# EAGLE design chainclock (EAGLE 7.7.0)
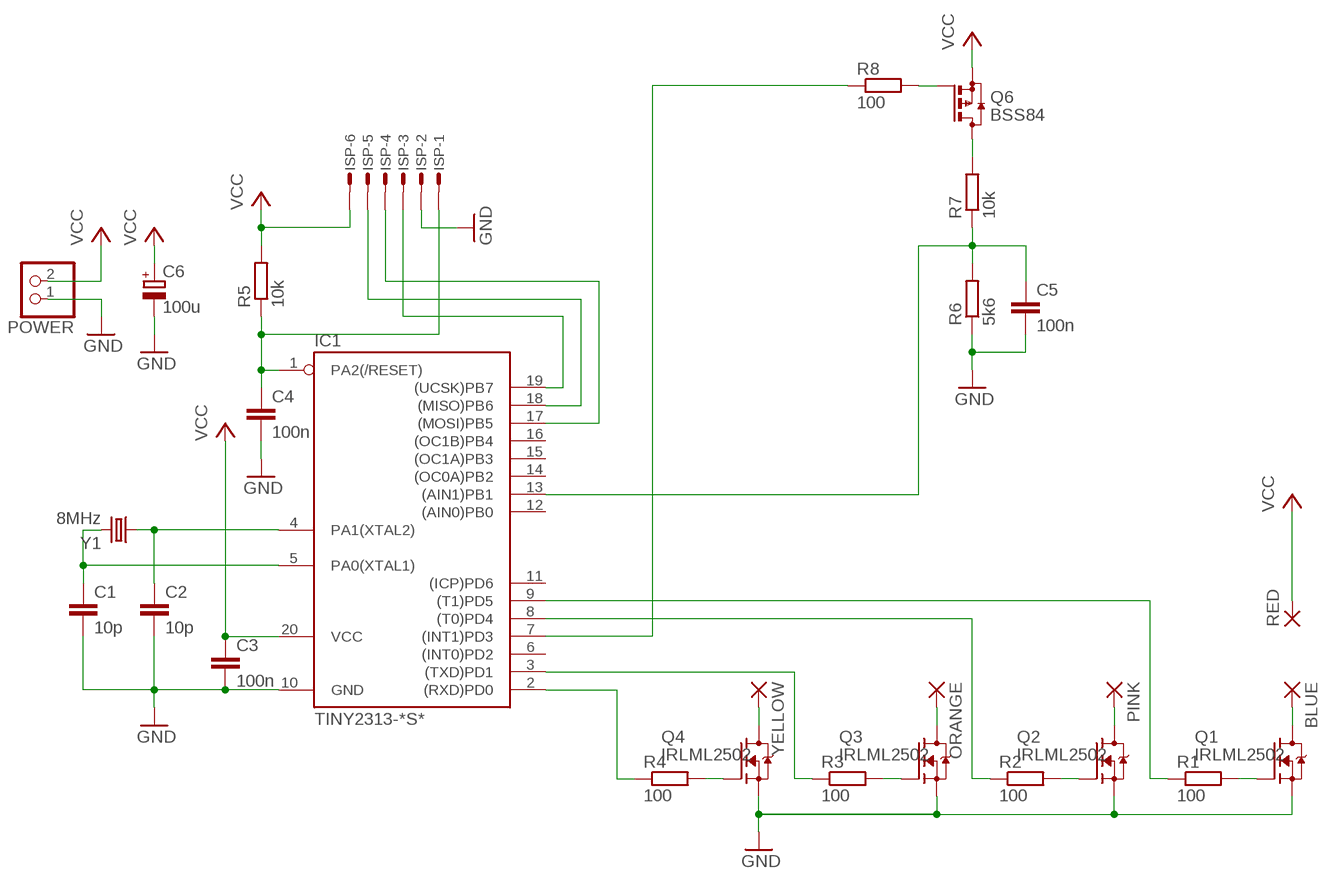
[diagram p0: schematic, sheet 1]

## Parts
BLUE  SMD2  [SMD1,27-2,54]
C1  10p  C-EUC0603  [C0603]
C2  10p  C-EUC0603  [C0603]
C3  100n  C-EUC0603  [C0603]
C4  100n  C-EUC0603  [C0603]
C5  100n  C-EUC0603  [C0603]
C6  100u  CPOL-EUE2.5-6  [E2,5-6]
IC1  TINY2313-*S*  [SO20L$]
ISP  MICROMATCH-6SMF  [MMT-F-SMD-6]
ORANGE  SMD2  [SMD1,27-2,54]
PINK  SMD2  [SMD1,27-2,54]
POWER  PINHD-1X2/90  [1X02/90]
Q1  IRLML2502  [SOT23-3]
Q2  IRLML2502  [SOT23-3]
Q3  IRLML2502  [SOT23-3]
Q4  IRLML2502  [SOT23-3]
Q6  BSS84  [SOT23]
R1  100  R-EU_R0603  [R0603]
R2  100  R-EU_R0603  [R0603]
R3  100  R-EU_R0603  [R0603]
R4  100  R-EU_R0603  [R0603]
R5  10k  R-EU_R0603  [R0603]
R6  5k6  R-EU_R0603  [R0603]
R7  10k  R-EU_R0603  [R0603]
R8  100  R-EU_R0603  [R0603]
RED  SMD2  [SMD1,27-2,54]
Y1  8MHz  CRYSTALHC49UP  [HC49UP]
YELLOW  SMD2  [SMD1,27-2,54]

## Nets
GND: C1.2 C2.2 C3.2 C4.2 C5.2 C6.- IC1.10(GND) ISP.2 POWER.1 Q1.2(S) Q2.2(S) Q3.2(S) Q4.2(S) R6.1
N$1: Q3.1(G) R3.2
N$2: Q4.1(G) R4.2
N$3: Q2.1(G) R2.2
N$4: Q1.1(G) R1.2
N$5: C4.1 IC1.1(PA2(/RESET)) ISP.1 R5.1
N$6: Q4.3(D) YELLOW.1(P)
N$7: ORANGE.1(P) Q3.3(D)
N$8: PINK.1(P) Q2.3(D)
N$9: BLUE.1(P) Q1.3(D)
N$10: C2.1 IC1.4(PA1(XTAL2)) Y1.1
N$11: C1.1 IC1.5(PA0(XTAL1)) Y1.2
N$12: IC1.19((UCSK)PB7) ISP.3
N$13: C5.1 IC1.13((AIN1)PB1) R6.2 R7.1
N$14: IC1.9((T1)PD5) R1.1
N$15: IC1.8((T0)PD4) R2.1
N$17: IC1.2((RXD)PD0) R4.1
N$18: Q6.3(D) R7.2
N$19: Q6.1(G) R8.2
N$20: IC1.7((INT1)PD3) R8.1
N$21: IC1.3((TXD)PD1) R3.1
N$63: IC1.17((MOSI)PB5) ISP.4
N$66: IC1.18((MISO)PB6) ISP.5
VCC: C3.1 C6.+ IC1.20(VCC) ISP.6 POWER.2 Q6.2(S) R5.2 RED.1(P)
Unconnected: IC1.6((INT0)PD2) IC1.11((ICP)PD6) IC1.12((AIN0)PB0) IC1.14((OC0A)PB2) IC1.15((OC1A)PB3) IC1.16((OC1B)PB4)

## Library data of the parts
BLUE ORANGE PINK RED YELLOW = wirepad:SMD2: SMD PAD
C1-C5 = rcl:C-EU: CAPACITOR, European symbol
C6 = rcl:CPOL-EU: POLARIZED CAPACITOR, European symbol
IC1 = avr-7:TINY2313*: Atmel Tiny2313 2K Flash, 128 bytes EEPROM, 128 bytes RAM
ISP = con-amp-micromatch2:MICROMATCH-6: MicroMaTch 6 7-215464-6 / 0-215464-6 Drawing Number C-215464 DDEController.pdf
POWER = pinhead:PINHD-1X2: PIN HEADER
Q1-Q4 = xmaker:IRLML2502: International Rectifier N-MOSFET.
Q6 = transistor-small-signal:BSS84: P-CHANNEL MOS FET
R1-R8 = resistor:R-EU_: RESISTOR, European symbol
Y1 = crystal:CRYSTAL: CRYSTAL; OC_FARNELL: unknown; OC_NEWARK: unknown

## Board
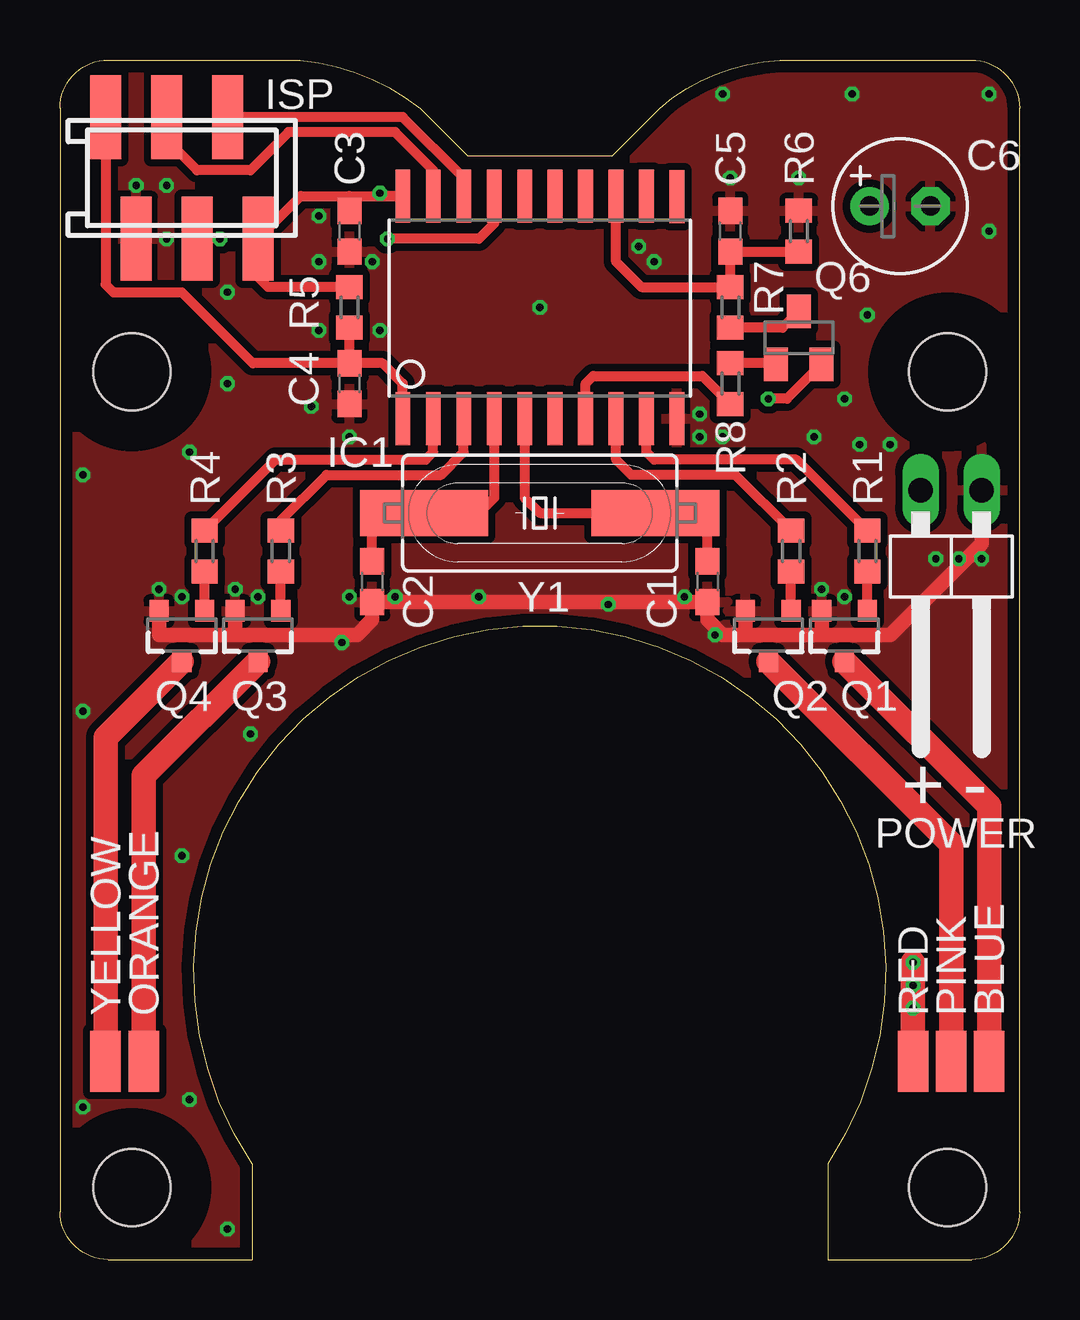
[diagram p1: board, top side]
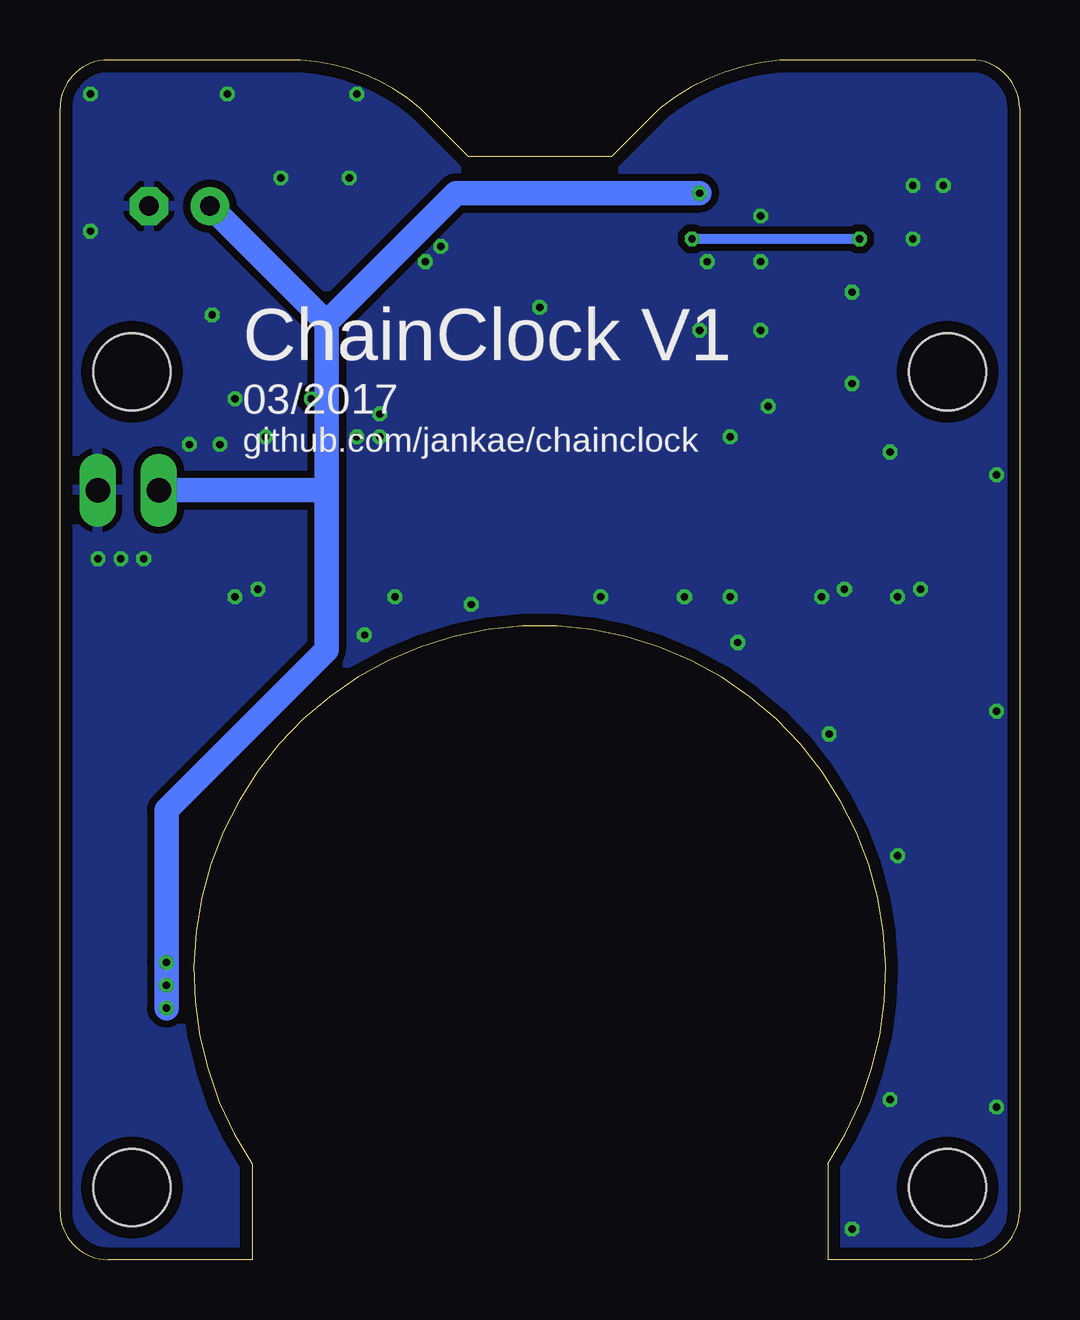
[diagram p2: board, bottom side, seen from below]

Size 40 x 50 mm. Coordinates in mm from the lower left corner, seen from the top.
Outline: 0,48 0,2 arc90 2,0 8,0 8,4 arc-247 32,4 32,0 38,0 arc90 40,2 40,48 arc90 38,50 30,50 arc37 25,48 23,46 17,46 15,48 arc33 10,50 2,50 arc90 0,48
Copper layers (1*16): Top 0.035mm / dielectric 1.6mm / Bottom 0.035mm
Design rules "Elecrow_2-layer_PCB_eagle_rule": minimum track width 6mil, minimum drill 12mil, track to track 6mil, track to pad 6mil, pad to pad 6mil, via to via 8mil, smd to smd 0mil, copper to edge 20mil, drill to drill 10mil, minimum pad ring 6mil, minimum via ring 6mil, stop-mask expansion 0mil, vias tented up to drill 100mil, thermal gap 10mil
Holes 3.2 mm at 3,3 37,3 3,37 37,37
tKeepout: area 0,0 to 6,6; area 34,0 to 40,6; area 34,34 to 40,40; area 0,34 to 6,40
tRestrict: area 0,34 to 6,40; area 34,34 to 40,40; area 0,0 to 6,6; area 34,0 to 40,6

### Footprints (pad centres in the part's own frame; a part is rotated, then mirrored left to right if it is on the bottom)
SMD1,27-2,54 = smd 1.27 x 2.54: 1 0,0
C0603 = smd 1.1 x 1: 1 -0.85,0; 2 0.85,0
E2,5-6 = drill 0.813 pad 1.6: + -1.27,0 | drill 0.813 pad 1.6 octagon: - 1.27,0
SO20L$ = smd 0.61 x 2.21: 1 -5.715,-4.636; 2 -4.445,-4.636; 3 -3.175,-4.636; 4 -1.905,-4.636; 5 -0.635,-4.636; 6 0.635,-4.636; 7 1.905,-4.636; 8 3.175,-4.636; 9 4.445,-4.636; 10 5.715,-4.636; 11 5.715,4.61; 12 4.445,4.636; 13 3.175,4.636; 14 1.905,4.636; 15 0.635,4.636; 16 -0.635,4.636; 17 -1.905,4.636; 18 -3.175,4.636; 19 -4.445,4.636; 20 -5.715,4.636
MMT-F-SMD-6 = smd 1.3 x 3.5: 1 3.175,-2.54; 2 1.905,2.54; 3 0.635,-2.54; 4 -0.635,2.54; 5 -1.905,-2.54; 6 -3.175,2.54
1X02/90 = drill 1.016 long: 1 -1.27,-3.81; 2 1.27,-3.81
SOT23-3 = smd 0.8 x 0.9: 1 -0.95,-1; 2 0.95,-1; 3 0,1.1
SOT23 = smd 1 x 1.4: 1 -0.95,-1.1; 2 0.95,-1.1; 3 0,1.1
R0603 = smd 1 x 1.1: 1 -0.85,0; 2 0.85,0
HC49UP = smd 5.334 x 1.93: 1 -4.826,0; 2 4.826,0

### Placement (x,y rotation side)
BLUE  38.73,8.26 0 top
C1  26.99,28.26 270 top
C2  13.02,28.26 270 top
C3  12.06,42.86 270 top
C4  12.06,36.51 270 top
C5  27.94,42.86 90 top
C6  35.02,43.91 0 top
IC1  20,39.69 0 top
ISP  5.08,45.09 180 top
ORANGE  3.49,8.26 0 top
PINK  37.15,8.26 0 top
POWER  37.15,28.26 180 top
Q1  32.7,26.04 180 top
Q2  29.53,26.04 180 top
Q3  8.26,26.04 180 top
Q4  5.08,26.04 180 top
Q6  30.8,38.42 0 top
R1  33.66,29.53 270 top
R2  30.48,29.53 270 top
R3  9.21,29.53 270 top
R4  6.03,29.53 270 top
R5  12.06,39.69 90 top
R6  30.8,42.86 270 top
R7  27.94,39.69 270 top
R8  27.94,36.51 90 top
RED  35.56,8.26 0 top
Y1  20,31.11 0 top
YELLOW  1.91,8.26 0 top

### Tracks (layer width: path | path; a pad name or v marks a point on that pad's centre or on a via)
GND  (via drill 0.3)
  Top 0.61: Q1.2 31.75,26.04 | 31.75,26.04 28.57,26.04 | 28.57,26.04 27.62,26.04 26.99,26.67 C1.2 C2.2 13.02,26.67 12.38,26.04 7.3,26.04 | Q2.2 28.57,26.04 | Q4.2 4.13,26.04 7.3,26.04 | 7.3,26.04 Q3.2 | POWER.1 38.42,29.84 34.61,26.04 31.75,26.04
  other vias: 4.13,27.94 7.3,27.94 31.75,27.94 12.06,27.62 13.97,27.62 26.04,27.62 32.7,27.62 5.08,27.62 8.26,27.62 3.17,44.77 26.67,34.29 26.67,35.24 27.3,26.04 38.42,29.21 37.47,29.21 36.51,29.21 34.61,33.97 33.34,33.97 31.43,34.29 32.7,35.88 33.66,39.37 27.94,45.09 30.8,45.09 38.73,48.58 27.62,48.58 33.02,48.58 38.73,42.86 27.62,34.29 24.77,41.59 24.13,42.23 20,39.69 13.02,41.59 13.34,38.73 10.79,41.59 10.79,43.5 10.79,38.73 6.99,40.32 12.06,34.29 10.48,35.56 5.4,6.67 5.08,16.83 7.94,21.91 11.75,25.72 17.46,27.62 22.86,27.3 0.95,6.35 0.95,22.86 0.95,32.7 5.4,33.66 6.99,36.51 4.45,44.77 4.45,42.55 6.99,1.27
  pour Bottom (isolate 0.305): -1.27,51.12 -1.27,-1.27 41.27,-1.27 41.27,51.12
  pour Top (isolate 0.305): -1.27,51.12 -1.27,-1.27 41.27,-1.27 41.27,51.12
N$1
  Top 0.406: Q3.1 R3.2
N$2
  Top 0.406: Q4.1 R4.2
N$3
  Top 0.406: Q2.1 R2.2
N$4
  Top 0.406: Q1.1 R1.2
N$5
  Top 0.406: ISP.1 1.91,40.64 2.22,40.32 5.08,40.32 8.04,37.36 C4.1 | C4.1 R5.1 | IC1.1 14.29,36.51 13.44,37.36 C4.1
N$6
  Top 1.016: YELLOW.1 1.91,21.76 Q4.3
N$7
  Top 1.016: ORANGE.1 3.49,20.17 Q3.3
N$8
  Top 1.016: PINK.1 37.15,17.32 Q2.3
N$9
  Top 1.016: BLUE.1 38.73,18.9 Q1.3
N$10
  Top 0.406: IC1.4 18.1,31.75 17.46,31.11 Y1.1 13.34,31.11 13.02,30.8 C2.1
N$11
  Top 0.406: IC1.5 19.37,31.75 20,31.11 Y1.2 26.99,31.11 C1.1
N$12
  Top 0.406: IC1.19 15.56,45.4 13.97,46.99 9.53,46.99 7.94,45.4 5.71,45.4 4.45,46.67 ISP.3
N$13
  Top 0.406: R6.2 C5.1 R7.1 24.23,40.54 23.18,41.59 IC1.13
N$14
  Top 0.406: R1.1 30.7,33.34 24.77,33.34 24.45,33.66 IC1.9
N$15
  Top 0.406: R2.1 28.16,32.7 23.81,32.7 23.18,33.34 IC1.8
N$17
  Top 0.406: R4.1 8.99,33.34 15.24,33.34 15.56,33.66 IC1.2
N$18
  Top 0.406: Q6.3 30.12,38.84 R7.2
N$19
  Top 0.406: Q6.1 29.8,37.36 R8.2
N$20
  Top 0.406: IC1.7 21.91,36.51 22.23,36.83 26.77,36.83 R8.1
N$21
  Top 0.406: R3.1 9.21,30.8 11.11,32.7 15.88,32.7 16.83,33.66 IC1.3
N$63  (via drill 0.3)
  Top 0.406: IC1.17 18.1,43.18 17.46,42.55 v13.65,42.55 | v6.67,42.55 ISP.4
  Bottom 0.406: v13.65,42.55 v6.67,42.55
N$66
  Top 0.406: IC1.18 16.83,45.09 14.29,47.62 ISP.5
VCC  (via drill 0.3)
  Top 0.406: v13.34,44.45 13.46,44.32 IC1.20 12.06,44.32 | 12.06,44.32 10.03,44.32 ISP.6 8.26,40.96 8.68,40.54 R5.2 | C3.1 12.06,44.32 | Q6.2 30.31,35.88 v29.53,35.88
  Top 1.016: v35.56,12.38 v35.56,11.43 v35.56,10.48 RED.1
  Bottom 0.406: v29.53,35.88 28.89,35.88
  Bottom 1.016: v35.56,10.48 v35.56,12.38 35.56,18.73 28.89,25.4 28.89,32.07 | 28.89,39.05 23.5,44.45 v13.34,44.45 | C6.+ 28.89,39.05 | 28.89,39.05 28.89,35.88 28.89,32.07 | POWER.2 28.89,32.07

### Text on the board
tPlace: + | -
bPlace: ChainClock V1 | 03/2017 | github.com/jankae/chainclock